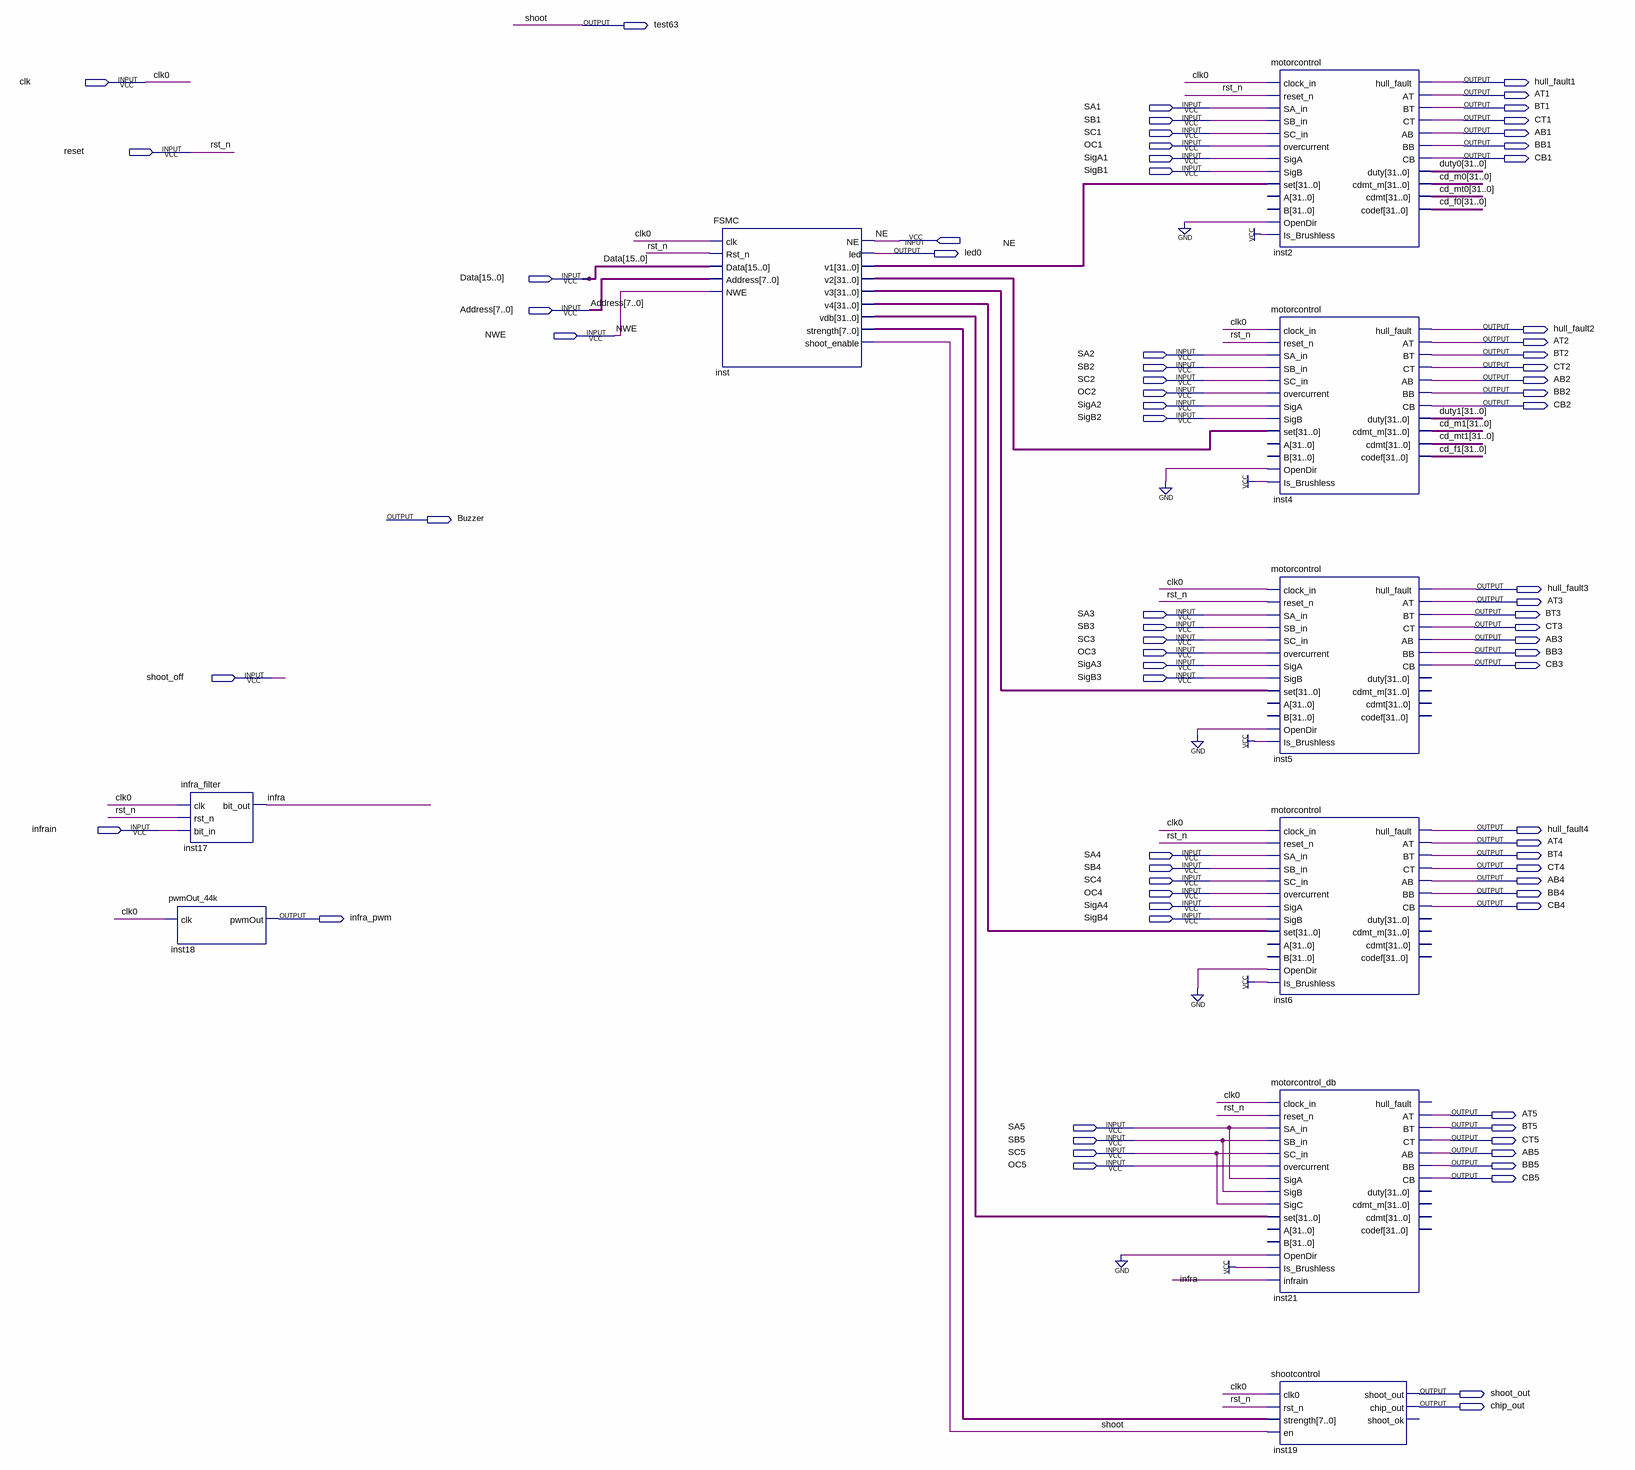
[diagram p0: schematic sheet]
// Quartus schematic SMALL_V14.bdf as structural Verilog: 9 symbols, 76 pins
module SMALL_V14 (
  input  clk,
  input  SA1,
  input  SB1,
  input  SC1,
  input  OC1,
  input  reset,
  input  SigA1,
  input  SigB1,
  input  NE,
  input  [15:0] Data,
  input  [7:0] Address,
  input  NWE,
  input  SA2,
  input  SB2,
  input  SC2,
  input  OC2,
  input  SigA2,
  input  SigB2,
  input  SA3,
  input  SB3,
  input  SC3,
  input  OC3,
  input  SigA3,
  input  shoot_off,
  input  SigB3,
  input  infrain,
  input  SA4,
  input  SB4,
  input  SC4,
  input  OC4,
  input  SigA4,
  input  SigB4,
  input  SA5,
  input  SB5,
  input  SC5,
  input  OC5,
  output test63,
  output hull_fault1,
  output AT1,
  output BT1,
  output CT1,
  output AB1,
  output BB1,
  output CB1,
  output led0,
  output hull_fault2,
  output AT2,
  output BT2,
  output CT2,
  output AB2,
  output BB2,
  output CB2,
  output Buzzer,
  output hull_fault3,
  output AT3,
  output BT3,
  output CT3,
  output AB3,
  output BB3,
  output CB3,
  output hull_fault4,
  output AT4,
  output BT4,
  output CT4,
  output AB4,
  output BB4,
  output CB4,
  output infra_pwm,
  output AT5,
  output BT5,
  output CT5,
  output AB5,
  output BB5,
  output CB5,
  output shoot_out,
  output chip_out
);

  wire infra;
  wire [7:0] inst_strength;
  wire [31:0] cd_f0, cd_f1, cd_m0, cd_m1, cd_mt0, cd_mt1, duty0, duty1, inst_v1, inst_v2, inst_v3, inst_v4,
       inst_vdb;

  infra_filter inst17 (.clk(clk), .rst_n(reset), .bit_in(infrain), .bit_out(infra));
  pwmOut_44k inst18 (.clk(clk), .pwmOut(infra_pwm));
  FSMC inst (
    .clk(clk), .Rst_n(reset), .Data(Data), .Address(Address), .NWE(NWE), .led(led0), .v1(inst_v1),
    .v2(inst_v2), .v3(inst_v3), .v4(inst_v4), .vdb(inst_vdb), .strength(inst_strength),
    .shoot_enable(test63), .NE(NE));
  motorcontrol inst2 (
    .clock_in(clk), .reset_n(reset), .SA_in(SA1), .SB_in(SB1), .SC_in(SC1), .overcurrent(OC1), .SigA(SigA1),
    .SigB(SigB1), .set(inst_v1), .OpenDir(1'b0), .Is_Brushless(1'b1), .hull_fault(hull_fault1), .AT(AT1),
    .BT(BT1), .CT(CT1), .AB(AB1), .BB(BB1), .CB(CB1), .duty(duty0), .cdmt_m(cd_m0), .cdmt(cd_mt0),
    .codef(cd_f0));  // open: A, B
  motorcontrol inst4 (
    .clock_in(clk), .reset_n(reset), .SA_in(SA2), .SB_in(SB2), .SC_in(SC2), .overcurrent(OC2), .SigA(SigA2),
    .SigB(SigB2), .set(inst_v2), .OpenDir(1'b0), .Is_Brushless(1'b1), .hull_fault(hull_fault2), .AT(AT2),
    .BT(BT2), .CT(CT2), .AB(AB2), .BB(BB2), .CB(CB2), .duty(duty1), .cdmt_m(cd_m1), .cdmt(cd_mt1),
    .codef(cd_f1));  // open: A, B
  motorcontrol inst5 (
    .clock_in(clk), .reset_n(reset), .SA_in(SA3), .SB_in(SB3), .SC_in(SC3), .overcurrent(OC3), .SigA(SigA3),
    .SigB(SigB3), .set(inst_v3), .OpenDir(1'b0), .Is_Brushless(1'b1), .hull_fault(hull_fault3), .AT(AT3),
    .BT(BT3), .CT(CT3), .AB(AB3), .BB(BB3), .CB(CB3));  // open: A, B, duty, cdmt_m, cdmt, codef
  motorcontrol inst6 (
    .clock_in(clk), .reset_n(reset), .SA_in(SA4), .SB_in(SB4), .SC_in(SC4), .overcurrent(OC4), .SigA(SigA4),
    .SigB(SigB4), .set(inst_v4), .OpenDir(1'b0), .Is_Brushless(1'b1), .hull_fault(hull_fault4), .AT(AT4),
    .BT(BT4), .CT(CT4), .AB(AB4), .BB(BB4), .CB(CB4));  // open: A, B, duty, cdmt_m, cdmt, codef
  motorcontrol_db inst21 (
    .clock_in(clk), .reset_n(reset), .SA_in(SA5), .SB_in(SB5), .SC_in(SC5), .overcurrent(OC5), .SigA(SA5),
    .SigB(SB5), .SigC(SC5), .set(inst_vdb), .OpenDir(1'b0), .Is_Brushless(1'b1), .infrain(infra), .AT(AT5),
    .BT(BT5), .CT(CT5), .AB(AB5), .BB(BB5), .CB(CB5));  // open: A, B, hull_fault, duty, cdmt_m, cdmt, codef
  shootcontrol inst19 (
    .clk0(clk), .rst_n(reset), .strength(inst_strength), .en(test63), .shoot_out(shoot_out),
    .chip_out(chip_out));  // open: shoot_ok

  // Other names for the same wires on the sheet: clk0 = clk; rst_n = reset; shoot = test63
endmodule
